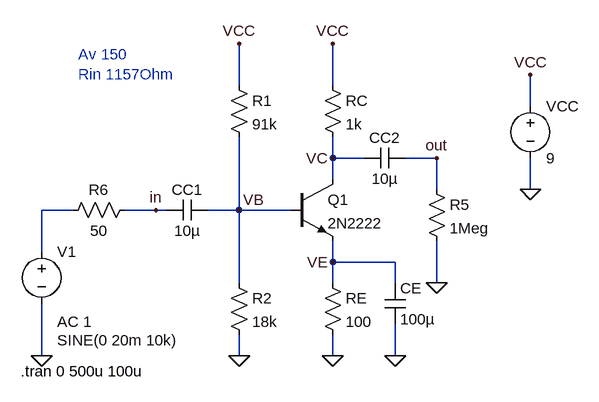
[diagram p0: schematic Perc-03-01-gainandinputresistance.asc]
Perc-03-01-gainandinputresistance.asc, the LTspice schematic file:
Version 4
SHEET 1 880 680
WIRE 128 48 128 -16
WIRE 272 48 272 -16
WIRE 576 80 576 32
WIRE 272 160 272 128
WIRE 320 160 272 160
WIRE 432 160 384 160
WIRE 272 192 272 160
WIRE 432 208 432 160
WIRE 576 208 576 160
WIRE -128 240 -176 240
WIRE 0 240 -48 240
WIRE 16 240 0 240
WIRE 128 240 128 128
WIRE 128 240 80 240
WIRE 208 240 128 240
WIRE -176 304 -176 240
WIRE 272 320 272 288
WIRE 368 320 272 320
WIRE 128 352 128 240
WIRE 272 352 272 320
WIRE 368 352 368 320
WIRE 432 352 432 288
WIRE -176 464 -176 384
WIRE 128 464 128 432
WIRE 272 464 272 432
WIRE 368 464 368 416
FLAG 368 464 0
FLAG 272 464 0
FLAG 128 464 0
FLAG 128 -16 VCC
FLAG 272 -16 VCC
FLAG 432 352 0
FLAG 576 208 0
FLAG 576 32 VCC
FLAG -176 464 0
FLAG 0 240 in
FLAG 432 160 out
FLAG 128 240 VB
FLAG 272 320 VE
FLAG 272 160 VC
SYMBOL npn 208 192 R0
SYMATTR InstName Q1
SYMATTR Value 2N2222
SYMBOL res 256 32 R0
SYMATTR InstName RC
SYMATTR Value 1k
SYMBOL res 112 32 R0
SYMATTR InstName R1
SYMATTR Value 91k
SYMBOL res 112 336 R0
SYMATTR InstName R2
SYMATTR Value 18k
SYMBOL res 256 336 R0
SYMATTR InstName RE
SYMATTR Value 100
SYMBOL cap 352 352 R0
SYMATTR InstName CE
SYMATTR Value 100µ
SYMBOL cap 384 144 R90
WINDOW 0 0 32 VBottom 2
WINDOW 3 32 32 VTop 2
SYMATTR InstName CC2
SYMATTR Value 10µ
SYMBOL cap 80 224 R90
WINDOW 0 0 32 VBottom 2
WINDOW 3 32 32 VTop 2
SYMATTR InstName CC1
SYMATTR Value 10µ
SYMBOL res 416 192 R0
SYMATTR InstName R5
SYMATTR Value 1Meg
SYMBOL voltage -176 288 R0
WINDOW 3 24 152 Left 2
WINDOW 123 24 124 Left 2
WINDOW 39 0 0 Left 0
SYMATTR Value SINE(0 20m 10k)
SYMATTR Value2 AC 1
SYMATTR InstName V1
SYMBOL voltage 576 64 R0
SYMATTR InstName VCC
SYMATTR Value 9
SYMBOL res -32 224 R90
WINDOW 0 0 56 VBottom 2
WINDOW 3 32 56 VTop 2
SYMATTR InstName R6
SYMATTR Value 50
TEXT -208 488 Left 2 !.tran 0 500u 100u
TEXT -120 0 Left 2 ;Av 150\nRin 1157Ohm

The netlist it stands for:
* Perc-03-01-gainandinputresistance.asc
Q1 VC VB VE 0 2N2222
RC VCC VC 1k
R1 VCC VB 91k
R2 VB 0 18k
RE VE 0 100
CE VE 0 100µ
CC2 out VC 10µ
CC1 VB in 10µ
R5 out 0 1Meg
V1 N001 0 SINE(0 20m 10k) AC 1
VCC VCC 0 9
R6 in N001 50
.model NPN NPN
.model PNP PNP
.lib standard.bjt
.tran 0 500u 100u
* Av 150
* Rin 1157Ohm
.backanno
.end

* Results of the author's LTspice run, read from the files saved beside the schematic
* Operating Point, zero values left out:
*   V(vc) = 4.46 V
*   V(vb) = 1.151 V
*   V(ve) = 456.3 mV
*   V(vcc) = 9 V
*   Ic(Q1) = 4.54 mA
*   Ib(Q1) = 22.3 µA
*   Ie(Q1) = -4.563 mA
*   I(Re) = 4.563 mA
*   I(R2) = 63.95 µA
*   I(R1) = 86.25 µA
*   I(Rc) = 4.54 mA
*   I(Vcc) = -4.627 mA
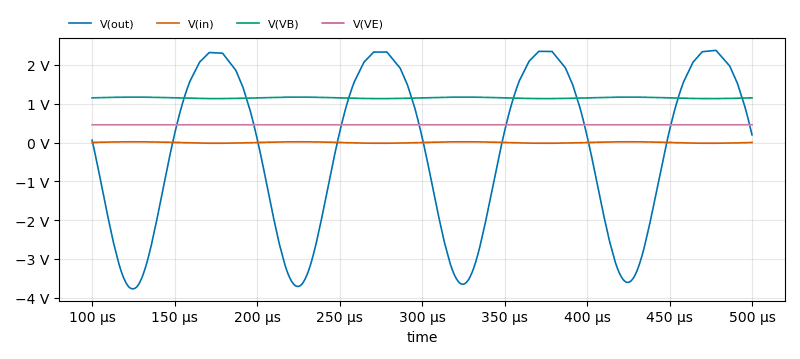
[diagram p1: Transient Analysis of Perc-03-01-gainandinputresistance.asc, plotted from the saved traces]
* Transient Analysis, 1 run:
*   V(out): min -3.772 V, max 2.376 V, average -233.2 mV, rms 2.16 V, last 197.9 mV
*   V(in): min -18.93 mV, max 18.95 mV, average 6.281 µV, rms 13.46 mV, last 3.678 µV
*   V(VB): min 1.132 V, max 1.17 V, average 1.151 V, rms 1.151 V, last 1.151 V
*   V(VE): min 456.6 mV, max 458.3 mV, average 457.5 mV, rms 457.5 mV, last 457.4 mV